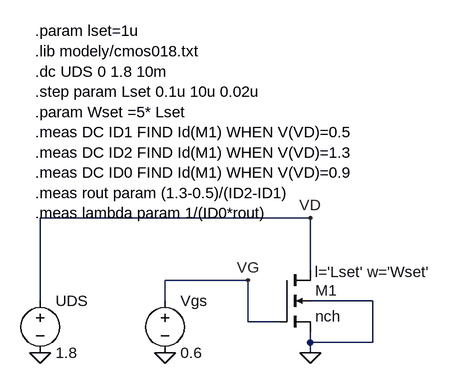
[diagram p0: schematic N4-mos.asc]
N4-mos.asc, the LTspice schematic file:
Version 4
SHEET 1 1544 680
WIRE 224 64 -192 64
WIRE 224 144 224 64
WIRE 128 160 0 160
WIRE -192 192 -192 64
WIRE 0 192 0 160
WIRE 320 192 224 192
WIRE 128 224 128 160
WIRE 176 224 128 224
WIRE 224 256 224 240
WIRE 320 256 320 192
WIRE 320 256 224 256
WIRE 224 272 224 256
FLAG 224 272 0
FLAG -192 272 0
FLAG 0 272 0
FLAG 128 160 VG
FLAG 224 64 VD
SYMBOL nmos4 176 144 R0
WINDOW 123 55 3 Left 2
SYMATTR Value2 l='Lset' w='Wset'
SYMATTR InstName M1
SYMATTR Value nch
SYMBOL voltage 0 176 R0
WINDOW 123 0 0 Left 0
WINDOW 39 0 0 Left 0
SYMATTR InstName Vgs
SYMATTR Value 0.6
SYMBOL voltage -192 176 R0
WINDOW 123 0 0 Left 0
WINDOW 39 0 0 Left 0
SYMATTR InstName UDS
SYMATTR Value 1.8
TEXT -200 -224 Left 2 !.param lset=1u\n.lib modely/cmos018.txt\n.dc UDS 0 1.8 10m\n.step param Lset 0.1u 10u 0.02u\n.param Wset =5* Lset\n.meas DC ID1 FIND Id(M1) WHEN V(VD)=0.5\n.meas DC ID2 FIND Id(M1) WHEN V(VD)=1.3\n.meas DC ID0 FIND Id(M1) WHEN V(VD)=0.9\n.meas rout param (1.3-0.5)/(ID2-ID1)\n.meas lambda param 1/(ID0*rout)

The netlist it stands for:
* N4-mos.asc
M1 VD VG 0 0 nch l='Lset' w='Wset'
Vgs VG 0 0.6
V§UDS VD 0 1.8
.model NMOS NMOS
.model PMOS PMOS
.lib standard.mos
.param lset=1u
.lib modely/cmos018.txt
.dc UDS 0 1.8 10m
.step param Lset 0.1u 10u 0.02u
.param Wset =5* Lset
.meas DC ID1 FIND Id(M1) WHEN V(VD)=0.5
.meas DC ID2 FIND Id(M1) WHEN V(VD)=1.3
.meas DC ID0 FIND Id(M1) WHEN V(VD)=0.9
.meas rout param (1.3-0.5)/(ID2-ID1)
.meas lambda param 1/(ID0*rout)
.backanno
.end

* Results of the author's LTspice run, read from the files saved beside the schematic
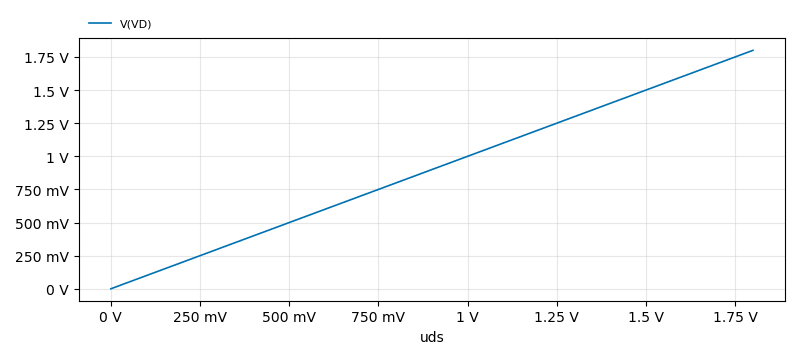
[diagram p1: DC transfer characteristic of N4-mos.asc, plotted from the saved traces]
* DC transfer characteristic, 1 run:
*   V(VD): 0 V at uds=0 V, 1.8 V at uds=1.8 V, min 0 V, max 1.8 V
* From the log:
*   id1: id(m1)=2.41256e-05 at 0.5
*   id2: id(m1)=2.49863e-05 at 1.3
*   id0: id(m1)=2.45701e-05 at 0.9
*   rout: (1.3-0.5)/(id2-id1)=929444
*   lambda: 1/(id0*rout)=0.0437895